# EAGLE design MicroCutter (EAGLE 7.3.0)
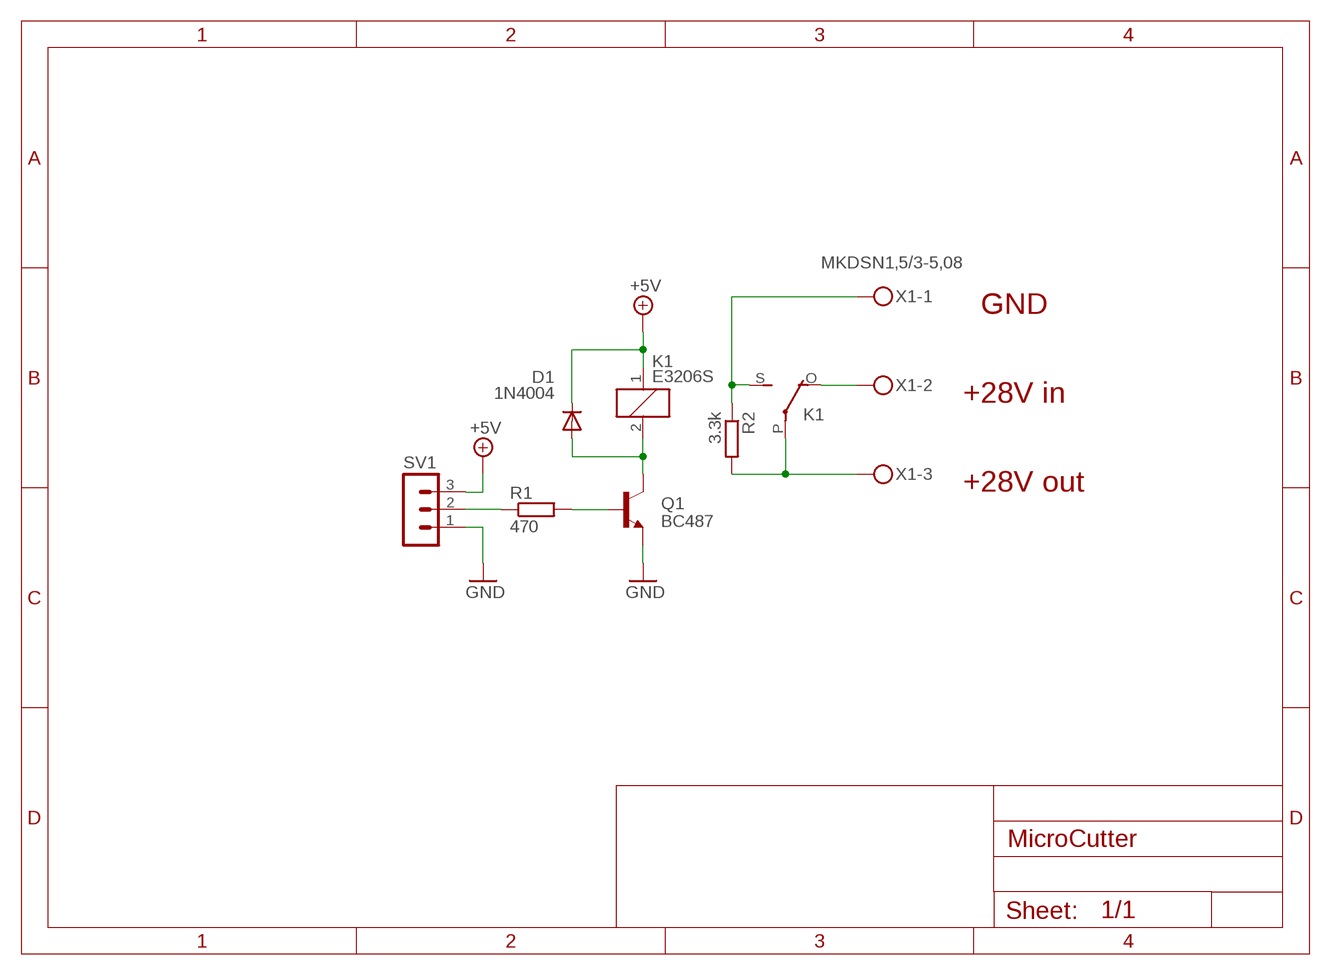
[diagram p0: schematic, sheet 1]

## Parts
D1  1N4004  [DO41-10]
K1  E3206S  [E3206S]
Q1  BC487  [TO92-EBC]
R1  470  R-EU_0309/12  [0309/12]
R2  3.3k  R-EU_0309/12  [0309/12]
SV1  MA03-1  [MA03-1]
X1  MKDSN1,5/3-5,08  [MKDSN1,5/3-5,08]

## Nets
+5V: D1.C K1.1 SV1.3
GND: Q1.E SV1.1
N$1: D1.A K1.2 Q1.C
N$2: K1.P(2:P) R2.2 X1.3
N$3: K1.O(2:O) X1.2
N$4: K1.S(2:S) R2.1 X1.1
N$5: Q1.B R1.2
N$6: R1.1 SV1.2

## Notes on the sheet
- GND
- +28V in
- +28V out

## Library data of the parts
D1 = diode:1N4004: DIODE general purpose rectifier, 1 A
K1 = relay:E3206S: RELAY 1 x switch, Eichhoff/distributor Schukat; OC_FARNELL: unknown; OC_NEWARK: unknown
Q1 = transistor-npn:BC487*: NPN Transistor
R1 R2 = rcl:R-EU_: RESISTOR, European symbol
SV1 = con-lstb:MA03-1: PIN HEADER; OC_FARNELL: unknown; OC_NEWARK: unknown
X1 = con-phoenix-508:MKDSN1,5/3-5,08: MKDSN 1,5/ 3-5,08 Printklemme Nennstrom: 13,5 A Nennspannung: 250 V Rastermaß: 5,08 mm Polzahl: 3 Anschlussart: Schraubanschluss Montage: Löten Anschlussrichtung Leiter/Platine: 0 ° Artikelnummer: 1729131 Source: http://eshop.phoenixcontact.com .. 1729131.pdf

## Board
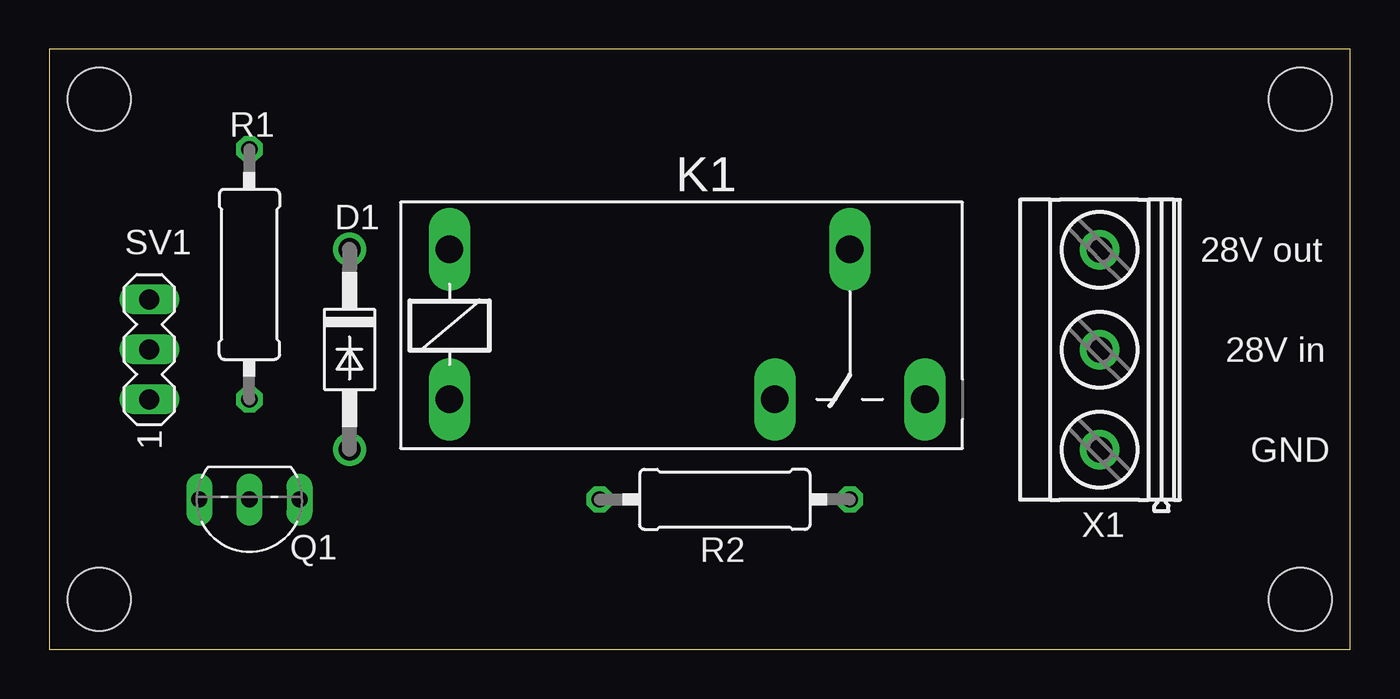
[diagram p1: board, top side]
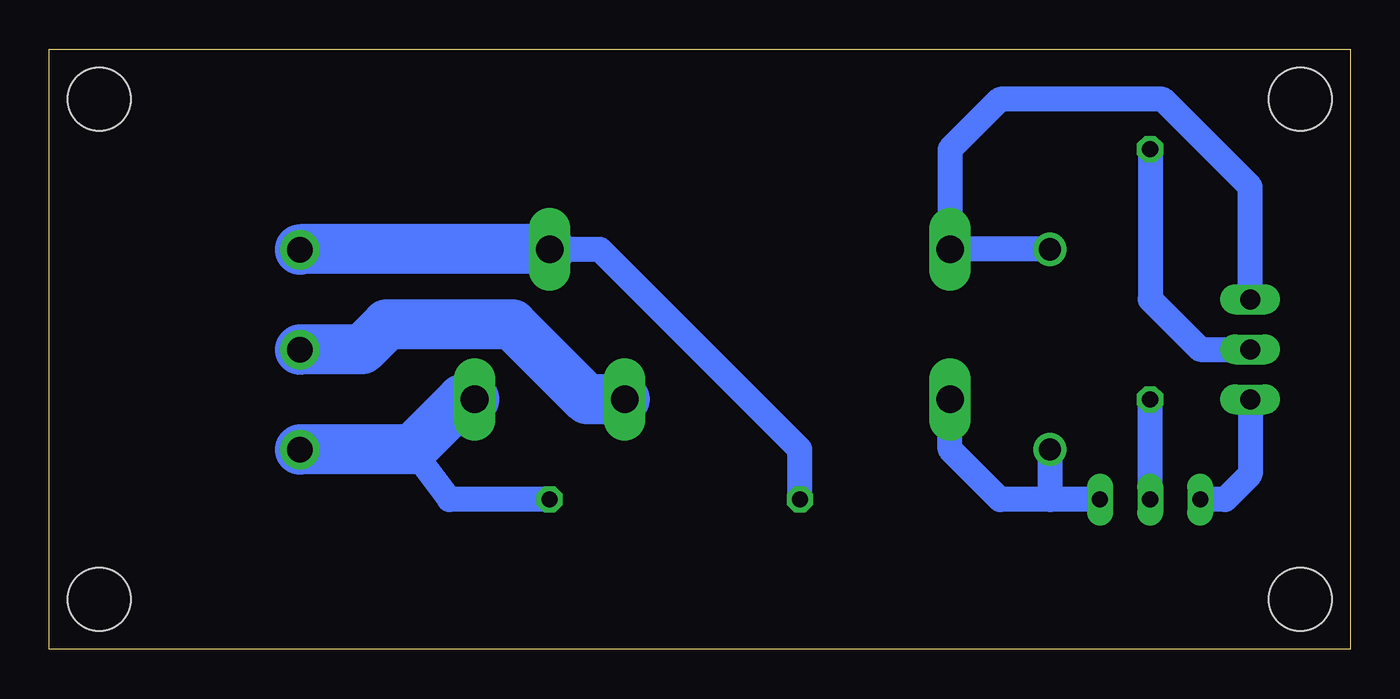
[diagram p2: board, bottom side, seen from below]

Size 66.04 x 30.48 mm. Coordinates in mm from the lower left corner, seen from the top.
Outline: 0,0 66.04,0 66.04,30.48 0,30.48 0,0
Copper layers (1*16): Top 0.035mm / dielectric 1.5mm / Bottom 0.035mm
Design rules "default": minimum track width 10mil, minimum drill 24mil, track to track 8mil, track to pad 8mil, pad to pad 8mil, via to via 8mil, smd to smd 8mil, copper to edge 40mil, drill to drill 8mil, minimum pad ring 10mil, minimum via ring 8mil, stop-mask expansion 4mil, vias tented up to drill 0mil, thermal gap 10mil
Holes 3.2 mm at 2.54,27.94 2.54,2.54 63.5,27.94 63.5,2.54

### Footprints (pad centres in the part's own frame; a part is rotated, then mirrored left to right if it is on the bottom)
DO41-10 = drill 1.118: A 5.08,0; C -5.08,0
E3206S = drill 1.397 long: 1 -3.175,3.81; 2 -3.175,-3.81; O 13.335,-3.81; P 17.145,3.81; S 20.955,-3.81
TO92-EBC = drill 0.813 long: B 0,-1.27; C -2.54,-1.27; E 2.54,-1.27
0309/12 = drill 0.813 octagon: 1 -6.35,0; 2 6.35,0
MA03-1 = drill 1.016 long: 1 -2.54,0; 2 0,0; 3 2.54,0
MKDSN1,5/3-5,08 = drill 1.3 pad 2: 1 -7.641,0.025; 2 -2.561,0.025; 3 2.519,0.025

### Placement (x,y rotation side)
D1  15.24,15.24 270 top
K1  23.5,16.51 0 top
Q1  10.16,6.35 180 top
R1  10.16,19.05 270 top
R2  34.29,7.62 180 top
SV1  5.08,15.24 90 top
X1  53.34,17.78 90 top

### Tracks (layer width: path | path; a pad name or v marks a point on that pad's centre or on a via)
+5V
  Bottom 1.27: SV1.3 5.08,23.5 9.53,27.94 17.78,27.94 20.32,25.4 K1.1 D1.C
GND
  Bottom 1.27: SV1.1 5.08,8.89 6.35,7.62 Q1.E
N$1
  Bottom 1.27: Q1.C 15.24,7.62 | 15.24,7.62 17.78,7.62 20.32,10.16 K1.2 | D1.A 15.24,7.62
N$2
  Bottom 1.27: K1.P 38.1,20.32 27.94,10.16 R2.2
  Bottom 2.54: K1.P 53.31,20.32 X1.3
N$3
  Bottom 2.54: K1.O 38.73,12.7 42.55,16.51 48.9,16.51 50.16,15.24 53.29,15.24 X1.2
N$4
  Bottom 1.27: 47.62,10.16 45.72,7.62 R2.1
  Bottom 2.54: K1.S 45.09,12.7 47.62,10.16 53.29,10.16 X1.1
N$5
  Bottom 1.27: Q1.B R1.2
N$6
  Bottom 1.27: R1.1 10.16,17.78 7.62,15.24 SV1.2

### Text on the board
tPlace: 28V out | 28V in | GND